# EAGLE design pucktronix.snake.corral.schematic (EAGLE 5.11)
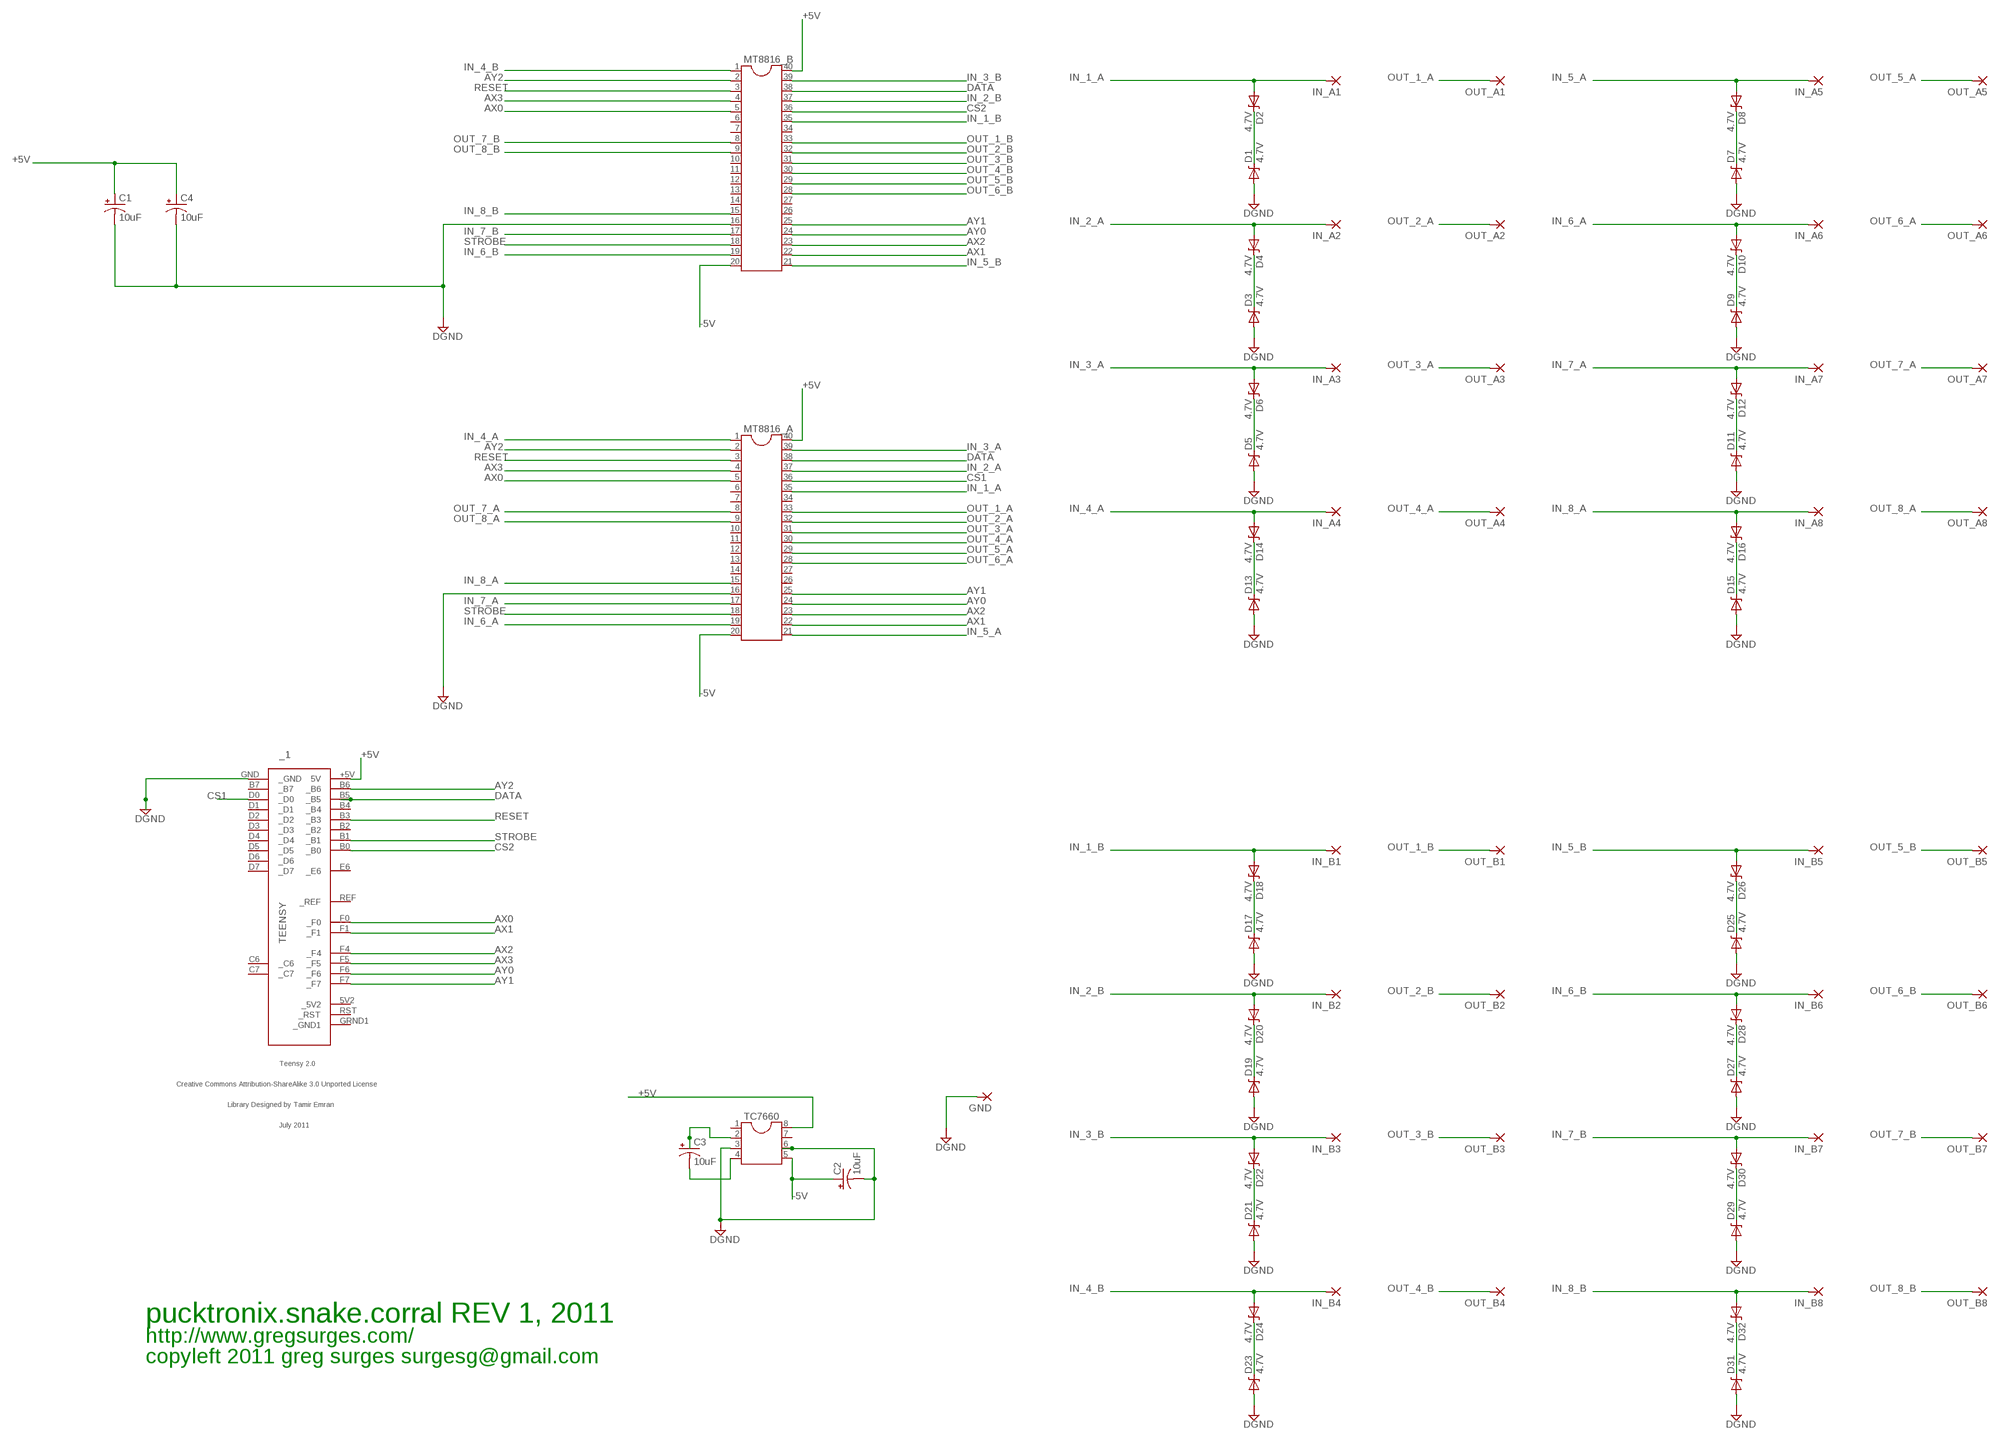
[diagram p0: schematic, sheet 1]

## Parts
_1  TEENSY  [TEENSY]
C1  10uF  CPOL-USE2.5-6  [E2,5-6]
C2  10uF  CPOL-USE2.5-6  [E2,5-6]
C3  10uF  CPOL-USE2.5-6  [E2,5-6]
C4  10uF  CPOL-USE2.5-6  [E2,5-6]
D1  4.7V  DIODE-ZENERPTH  [DIODE-ZENER]
D2  4.7V  DIODE-ZENERPTH  [DIODE-ZENER]
D3  4.7V  DIODE-ZENERPTH  [DIODE-ZENER]
D4  4.7V  DIODE-ZENERPTH  [DIODE-ZENER]
D5  4.7V  DIODE-ZENERPTH  [DIODE-ZENER]
D6  4.7V  DIODE-ZENERPTH  [DIODE-ZENER]
D7  4.7V  DIODE-ZENERPTH  [DIODE-ZENER]
D8  4.7V  DIODE-ZENERPTH  [DIODE-ZENER]
D9  4.7V  DIODE-ZENERPTH  [DIODE-ZENER]
D10  4.7V  DIODE-ZENERPTH  [DIODE-ZENER]
D11  4.7V  DIODE-ZENERPTH  [DIODE-ZENER]
D12  4.7V  DIODE-ZENERPTH  [DIODE-ZENER]
D13  4.7V  DIODE-ZENERPTH  [DIODE-ZENER]
D14  4.7V  DIODE-ZENERPTH  [DIODE-ZENER]
D15  4.7V  DIODE-ZENERPTH  [DIODE-ZENER]
D16  4.7V  DIODE-ZENERPTH  [DIODE-ZENER]
D17  4.7V  DIODE-ZENERPTH  [DIODE-ZENER]
D18  4.7V  DIODE-ZENERPTH  [DIODE-ZENER]
D19  4.7V  DIODE-ZENERPTH  [DIODE-ZENER]
D20  4.7V  DIODE-ZENERPTH  [DIODE-ZENER]
D21  4.7V  DIODE-ZENERPTH  [DIODE-ZENER]
D22  4.7V  DIODE-ZENERPTH  [DIODE-ZENER]
D23  4.7V  DIODE-ZENERPTH  [DIODE-ZENER]
D24  4.7V  DIODE-ZENERPTH  [DIODE-ZENER]
D25  4.7V  DIODE-ZENERPTH  [DIODE-ZENER]
D26  4.7V  DIODE-ZENERPTH  [DIODE-ZENER]
D27  4.7V  DIODE-ZENERPTH  [DIODE-ZENER]
D28  4.7V  DIODE-ZENERPTH  [DIODE-ZENER]
D29  4.7V  DIODE-ZENERPTH  [DIODE-ZENER]
D30  4.7V  DIODE-ZENERPTH  [DIODE-ZENER]
D31  4.7V  DIODE-ZENERPTH  [DIODE-ZENER]
D32  4.7V  DIODE-ZENERPTH  [DIODE-ZENER]
GND  3,81/1,4  [3,81/1,4]
IN_A1  3,81/1,4  [3,81/1,4]
IN_A2  3,81/1,4  [3,81/1,4]
IN_A3  3,81/1,4  [3,81/1,4]
IN_A4  3,81/1,4  [3,81/1,4]
IN_A5  3,81/1,4  [3,81/1,4]
IN_A6  3,81/1,4  [3,81/1,4]
IN_A7  3,81/1,4  [3,81/1,4]
IN_A8  3,81/1,4  [3,81/1,4]
IN_B1  3,81/1,4  [3,81/1,4]
IN_B2  3,81/1,4  [3,81/1,4]
IN_B3  3,81/1,4  [3,81/1,4]
IN_B4  3,81/1,4  [3,81/1,4]
IN_B5  3,81/1,4  [3,81/1,4]
IN_B6  3,81/1,4  [3,81/1,4]
IN_B7  3,81/1,4  [3,81/1,4]
IN_B8  3,81/1,4  [3,81/1,4]
MT8816_A  DIL40  [DIL40]
MT8816_B  DIL40  [DIL40]
OUT_A1  3,81/1,4  [3,81/1,4]
OUT_A2  3,81/1,4  [3,81/1,4]
OUT_A3  3,81/1,4  [3,81/1,4]
OUT_A4  3,81/1,4  [3,81/1,4]
OUT_A5  3,81/1,4  [3,81/1,4]
OUT_A6  3,81/1,4  [3,81/1,4]
OUT_A7  3,81/1,4  [3,81/1,4]
OUT_A8  3,81/1,4  [3,81/1,4]
OUT_B1  3,81/1,4  [3,81/1,4]
OUT_B2  3,81/1,4  [3,81/1,4]
OUT_B3  3,81/1,4  [3,81/1,4]
OUT_B4  3,81/1,4  [3,81/1,4]
OUT_B5  3,81/1,4  [3,81/1,4]
OUT_B6  3,81/1,4  [3,81/1,4]
OUT_B7  3,81/1,4  [3,81/1,4]
OUT_B8  3,81/1,4  [3,81/1,4]
TC7660  DIL8  [DIL08]

## Nets
+5V: _1.+5V(5V) C1.+ C4.+ MT8816_A.40 MT8816_B.40 TC7660.8
-5V: C2.+ MT8816_A.20 MT8816_B.20 TC7660.5
AX0: _1.F0(_F0) MT8816_A.5 MT8816_B.5
AX1: _1.F1(_F1) MT8816_A.22 MT8816_B.22
AX2: _1.F4(_F4) MT8816_A.23 MT8816_B.23
AX3: _1.F5(_F5) MT8816_A.4 MT8816_B.4
AY0: _1.F6(_F6) MT8816_A.24 MT8816_B.24
AY1: _1.F7(_F7) MT8816_A.25 MT8816_B.25
AY2: _1.B6(_B6) MT8816_A.2 MT8816_B.2
CS1: _1.D0(_D0) MT8816_A.36
CS2: _1.B0(_B0) MT8816_B.36
DATA: _1.B5(_B5) MT8816_A.38 MT8816_B.38
DGND: _1.GND(_GND) C1.- C2.- C4.- D1.P$2(A) D3.P$2(A) D5.P$2(A) D7.P$2(A) D9.P$2(A) D11.P$2(A) D13.P$2(A) D15.P$2(A) D17.P$2(A) D19.P$2(A) D21.P$2(A) D23.P$2(A) D25.P$2(A) D27.P$2(A) D29.P$2(A) D31.P$2(A) GND.1(P) MT8816_A.16 MT8816_B.16 TC7660.3 TC7660.6
IN_1_A: D2.P$2(A) IN_A1.1(P) MT8816_A.35
IN_1_B: D18.P$2(A) IN_B1.1(P) MT8816_B.35
IN_2_A: D4.P$2(A) IN_A2.1(P) MT8816_A.37
IN_2_B: D20.P$2(A) IN_B2.1(P) MT8816_B.37
IN_3_A: D6.P$2(A) IN_A3.1(P) MT8816_A.39
IN_3_B: D22.P$2(A) IN_B3.1(P) MT8816_B.39
IN_4_A: D14.P$2(A) IN_A4.1(P) MT8816_A.1
IN_4_B: D24.P$2(A) IN_B4.1(P) MT8816_B.1
IN_5_A: D8.P$2(A) IN_A5.1(P) MT8816_A.21
IN_5_B: D26.P$2(A) IN_B5.1(P) MT8816_B.21
IN_6_A: D10.P$2(A) IN_A6.1(P) MT8816_A.19
IN_6_B: D28.P$2(A) IN_B6.1(P) MT8816_B.19
IN_7_A: D12.P$2(A) IN_A7.1(P) MT8816_A.17
IN_7_B: D30.P$2(A) IN_B7.1(P) MT8816_B.17
IN_8_A: D16.P$2(A) IN_A8.1(P) MT8816_A.15
IN_8_B: D32.P$2(A) IN_B8.1(P) MT8816_B.15
N$1: D1.P$1(C) D2.P$1(C)
N$2: D3.P$1(C) D4.P$1(C)
N$3: D5.P$1(C) D6.P$1(C)
N$4: C3.+ TC7660.2
N$5: D7.P$1(C) D8.P$1(C)
N$6: D9.P$1(C) D10.P$1(C)
N$7: C3.- TC7660.4
N$8: D11.P$1(C) D12.P$1(C)
N$9: D13.P$1(C) D14.P$1(C)
N$10: D15.P$1(C) D16.P$1(C)
N$11: D17.P$1(C) D18.P$1(C)
N$12: D19.P$1(C) D20.P$1(C)
N$13: D21.P$1(C) D22.P$1(C)
N$14: D23.P$1(C) D24.P$1(C)
N$15: D25.P$1(C) D26.P$1(C)
N$16: D27.P$1(C) D28.P$1(C)
N$17: D29.P$1(C) D30.P$1(C)
N$18: D31.P$1(C) D32.P$1(C)
OUT_1_A: MT8816_A.33 OUT_A1.1(P)
OUT_1_B: MT8816_B.33 OUT_B1.1(P)
OUT_2_A: MT8816_A.32 OUT_A2.1(P)
OUT_2_B: MT8816_B.32 OUT_B2.1(P)
OUT_3_A: MT8816_A.31 OUT_A3.1(P)
OUT_3_B: MT8816_B.31 OUT_B3.1(P)
OUT_4_A: MT8816_A.30 OUT_A4.1(P)
OUT_4_B: MT8816_B.30 OUT_B4.1(P)
OUT_5_A: MT8816_A.29 OUT_A5.1(P)
OUT_5_B: MT8816_B.29 OUT_B5.1(P)
OUT_6_A: MT8816_A.28 OUT_A6.1(P)
OUT_6_B: MT8816_B.28 OUT_B6.1(P)
OUT_7_A: MT8816_A.8 OUT_A7.1(P)
OUT_7_B: MT8816_B.8 OUT_B7.1(P)
OUT_8_A: MT8816_A.9 OUT_A8.1(P)
OUT_8_B: MT8816_B.9 OUT_B8.1(P)
RESET: _1.B3(_B3) MT8816_A.3 MT8816_B.3
STROBE: _1.B1(_B1) MT8816_A.18 MT8816_B.18
Unconnected: _1.5V2(_5V2) _1.B2(_B2) _1.B4(_B4) _1.B7(_B7) _1.C6(_C6) _1.C7(_C7) _1.D1(_D1) _1.D2(_D2) _1.D3(_D3) _1.D4(_D4) _1.D5(_D5) _1.D6(_D6) _1.D7(_D7) _1.E6(_E6) _1.GRND1(_GND1) _1.REF(_REF) _1.RST(_RST) MT8816_A.6 MT8816_A.7 MT8816_A.10 MT8816_A.11 MT8816_A.12 MT8816_A.13 MT8816_A.14 MT8816_A.26 MT8816_A.27 MT8816_A.34 MT8816_B.6 MT8816_B.7 MT8816_B.10 MT8816_B.11 MT8816_B.12 MT8816_B.13 MT8816_B.14 MT8816_B.26 MT8816_B.27 MT8816_B.34 TC7660.1 TC7660.7

## Notes on the sheet
- pucktronix.snake.corral REV 1, 2011
- http://www.gregsurges.com/
- copyleft 2011 greg surges surgesg@gmail.com

## Library data of the parts
_1 = teensy:TEENSY: Teensy 2.0 Original Design by Clint Fisher Modified Design by Tamir Emran Licensed Under Creative Commons Attribution-ShareAlike 3.0 Unported (CC BY-SA 3.0)
C1-C4 = rcl:CPOL-US: POLARIZED CAPACITOR, American symbol
D1-D32 = SparkFun:DIODE-ZENER: Zener Diode Production Part - 8199 3.4V Zener Voltage
GND IN_A1-IN_A8 IN_B1-IN_B8 OUT_A1-OUT_A8 OUT_B1-OUT_B8 = wirepad:3,81/1,4: THROUGH-HOLE PAD
MT8816_A MT8816_B = ic-package:DIL40: Dual In Line
TC7660 = ic-package:DIL8: Dual In Line / Socket

## Board
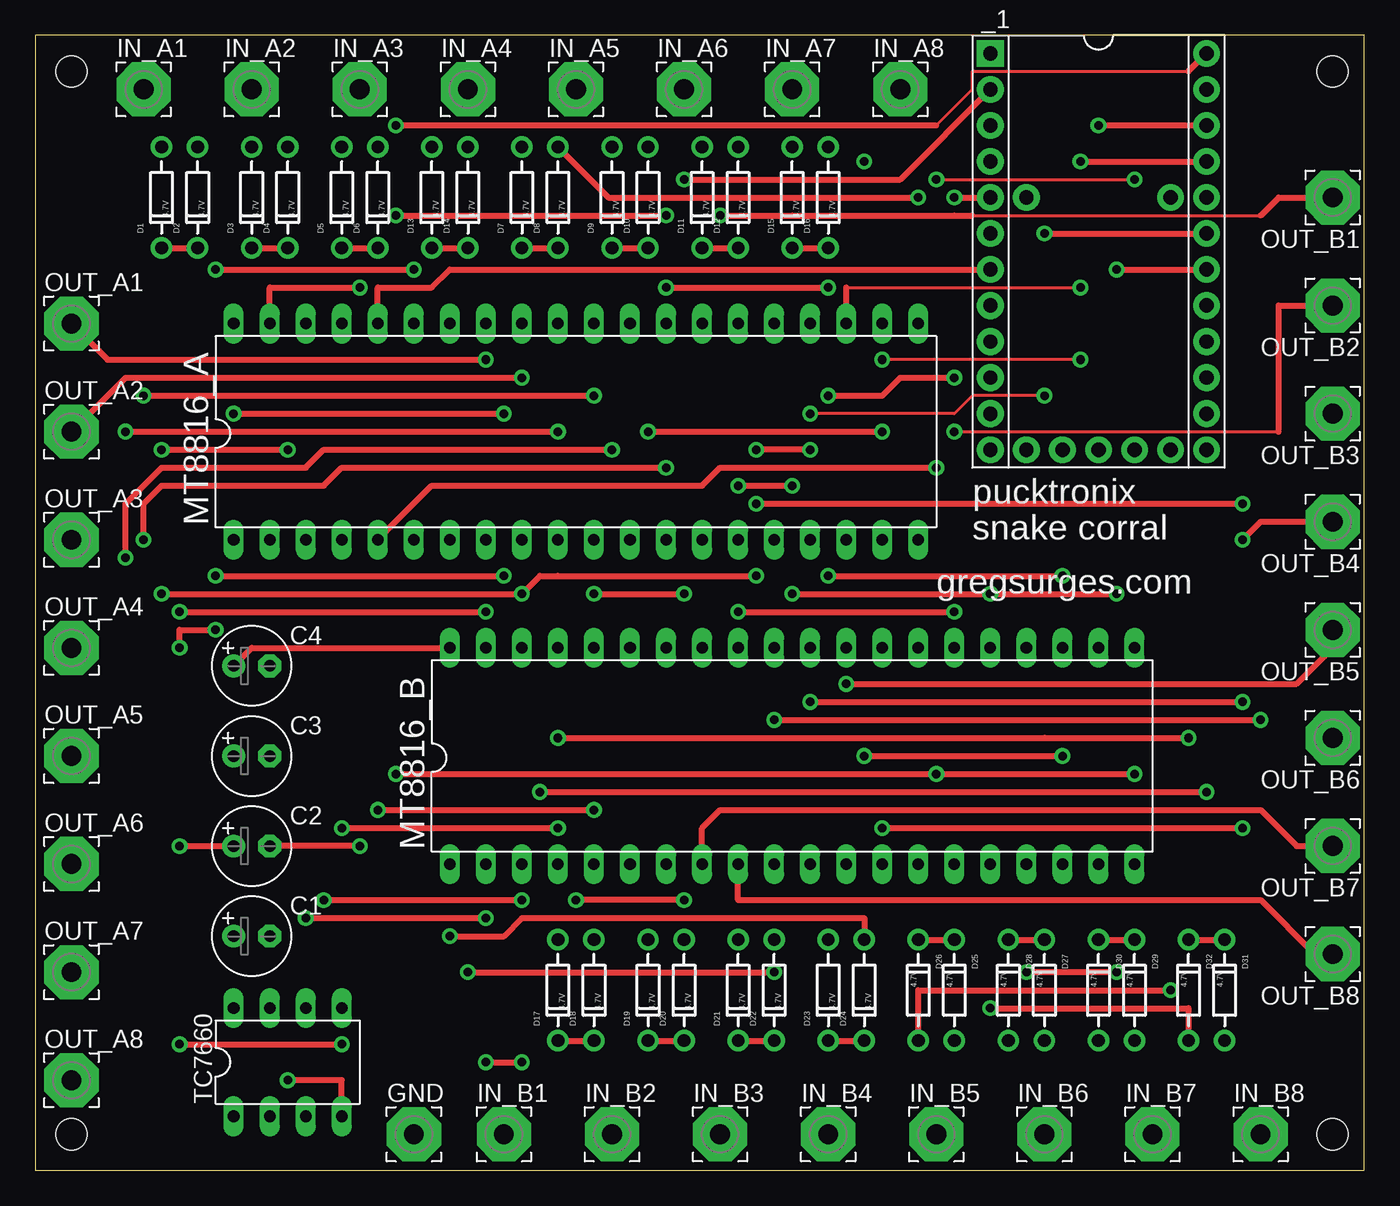
[diagram p1: board, top side]
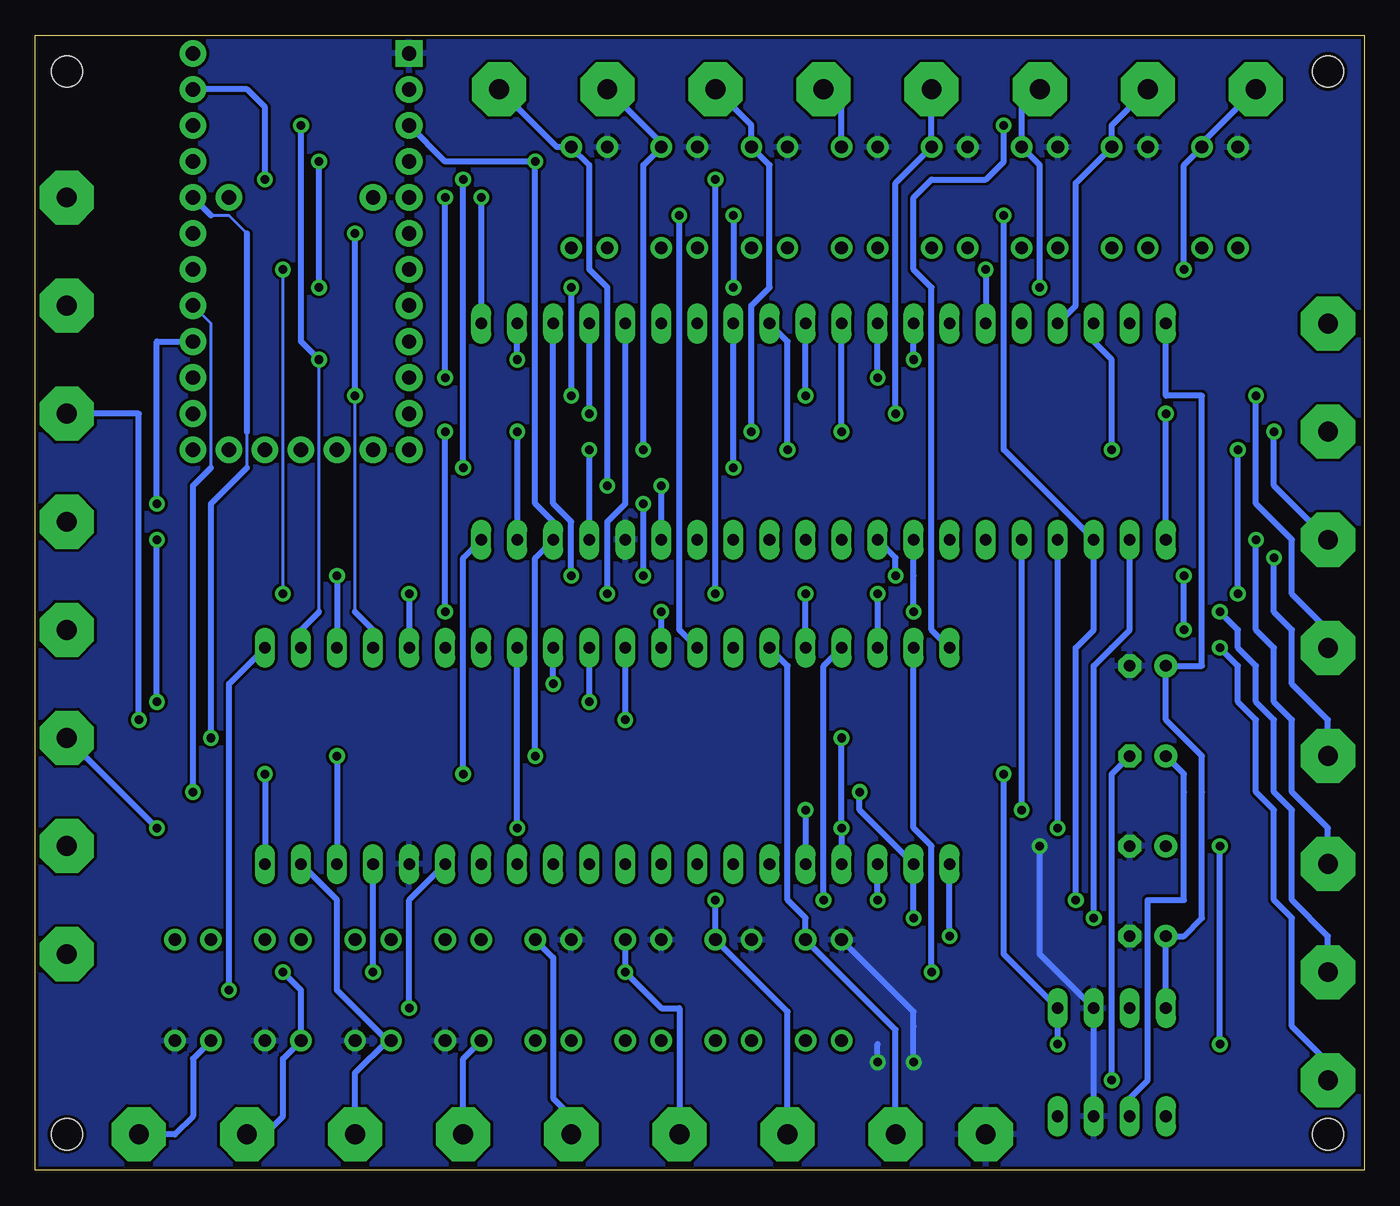
[diagram p2: board, bottom side, seen from below]

Size 93.65 x 80 mm. Coordinates in mm from the lower left corner, seen from the top.
Outline: 0,0 93.65,0 93.65,80 0,80 0,0
Copper layers (1*16): Top 0.035mm / dielectric 1.5mm / Bottom 0.035mm
Design rules "SparkFun": minimum track width 8mil, minimum drill 20mil, track to track 8mil, track to pad 8mil, pad to pad 8mil, via to via 8mil, smd to smd 8mil, copper to edge 10mil, drill to drill 8mil, minimum pad ring 12mil, minimum via ring 10mil, stop-mask expansion 4mil, vias tented up to drill 25mil, thermal gap 10mil
Holes 2.2 mm at 2.54,2.54 91.44,2.54 2.54,77.47 91.44,77.47

### Footprints (pad centres in the part's own frame; a part is rotated, then mirrored left to right if it is on the bottom)
TEENSY = drill 1.016 pad 1.88 round: 5V2 13.97,-2.54; +5V -13.97,7.62; B0 -11.43,-7.62; B1 -8.89,-7.62; B2 -6.35,-7.62; B3 -3.81,-7.62; B4 8.89,7.62; B5 6.35,7.62; B6 3.81,7.62; B7 -1.27,-7.62; C6 11.43,-7.62; C7 13.97,-7.62; D0 1.27,-7.62; D1 3.81,-7.62; D2 6.35,-7.62; D3 8.89,-7.62; D4 13.97,5.08; D5 13.97,-5.08; D6 13.97,7.62; D7 11.43,7.62; E6 -3.81,-5.08; F0 -11.43,7.62; F1 -8.89,7.62; F4 -6.35,7.62; F5 -3.81,7.62; F6 -1.27,7.62; F7 1.27,7.62; GRND1 13.97,0; REF -3.81,5.08; RST 13.97,2.54 | drill 1.016 pad 1.88 square: GND -13.97,-7.62
E2,5-6 = drill 0.813 pad 1.6 round: + -1.27,0 | drill 0.813 pad 1.6 octagon: - 1.27,0
DIODE-ZENER = drill 0.9 round: P$1 -3.556,0; P$2 3.556,0
3,81/1,4 = drill 1.397 pad 3.81 octagon: 1 0,0
DIL40 = drill 0.813 long: 1 -24.13,-7.62; 2 -21.59,-7.62; 3 -19.05,-7.62; 4 -16.51,-7.62; 5 -13.97,-7.62; 6 -11.43,-7.62; 7 -8.89,-7.62; 8 -6.35,-7.62; 9 -3.81,-7.62; 10 -1.27,-7.62; 11 1.27,-7.62; 12 3.81,-7.62; 13 6.35,-7.62; 14 8.89,-7.62; 15 11.43,-7.62; 16 13.97,-7.62; 17 16.51,-7.62; 18 19.05,-7.62; 19 21.59,-7.62; 20 24.13,-7.62; 21 24.13,7.62; 22 21.59,7.62; 23 19.05,7.62; 24 16.51,7.62; 25 13.97,7.62; 26 11.43,7.62; 27 8.89,7.62; 28 6.35,7.62; 29 3.81,7.62; 30 1.27,7.62; 31 -1.27,7.62; 32 -3.81,7.62; 33 -6.35,7.62; 34 -8.89,7.62; 35 -11.43,7.62; 36 -13.97,7.62; 37 -16.51,7.62; 38 -19.05,7.62; 39 -21.59,7.62; 40 -24.13,7.62
DIL08 = drill 0.813 long: 1 -3.81,-3.81; 2 -1.27,-3.81; 3 1.27,-3.81; 4 3.81,-3.81; 5 3.81,3.81; 6 1.27,3.81; 7 -1.27,3.81; 8 -3.81,3.81

### Placement (x,y rotation side)
_1  74.93,64.77 270 top
C1  15.24,16.51 0 top
C2  15.24,22.86 0 top
C3  15.24,29.21 0 top
C4  15.24,35.56 0 top
D1  8.89,68.58 90 top
D2  11.43,68.58 90 top
D3  15.24,68.58 90 top
D4  17.78,68.58 90 top
D5  21.59,68.58 90 top
D6  24.13,68.58 90 top
D7  34.29,68.58 90 top
D8  36.83,68.58 90 top
D9  40.64,68.58 90 top
D10  43.18,68.58 90 top
D11  46.99,68.58 90 top
D12  49.53,68.58 90 top
D13  27.94,68.58 90 top
D14  30.48,68.58 90 top
D15  53.34,68.58 90 top
D16  55.88,68.58 90 top
D17  36.83,12.7 90 top
D18  39.37,12.7 90 top
D19  43.18,12.7 90 top
D20  45.72,12.7 90 top
D21  49.53,12.7 90 top
D22  52.07,12.7 90 top
D23  55.88,12.7 90 top
D24  58.42,12.7 90 top
D25  64.77,12.7 270 top
D26  62.23,12.7 270 top
D27  71.12,12.7 270 top
D28  68.58,12.7 270 top
D29  77.47,12.7 270 top
D30  74.93,12.7 270 top
D31  83.82,12.7 270 top
D32  81.28,12.7 270 top
GND  26.67,2.54 0 top
IN_A1  7.62,76.2 0 top
IN_A2  15.24,76.2 0 top
IN_A3  22.86,76.2 0 top
IN_A4  30.48,76.2 0 top
IN_A5  38.1,76.2 0 top
IN_A6  45.72,76.2 0 top
IN_A7  53.34,76.2 0 top
IN_A8  60.96,76.2 0 top
IN_B1  33.02,2.54 0 top
IN_B2  40.64,2.54 0 top
IN_B3  48.26,2.54 0 top
IN_B4  55.88,2.54 0 top
IN_B5  63.5,2.54 0 top
IN_B6  71.12,2.54 0 top
IN_B7  78.74,2.54 0 top
IN_B8  86.36,2.54 0 top
MT8816_A  38.1,52.07 0 top
MT8816_B  53.34,29.21 0 top
OUT_A1  2.54,59.69 0 top
OUT_A2  2.54,52.07 0 top
OUT_A3  2.54,44.45 0 top
OUT_A4  2.54,36.83 0 top
OUT_A5  2.54,29.21 0 top
OUT_A6  2.54,21.59 0 top
OUT_A7  2.54,13.97 0 top
OUT_A8  2.54,6.35 0 top
OUT_B1  91.44,68.58 180 top
OUT_B2  91.44,60.96 180 top
OUT_B3  91.44,53.34 180 top
OUT_B4  91.44,45.72 180 top
OUT_B5  91.44,38.1 180 top
OUT_B6  91.44,30.48 180 top
OUT_B7  91.44,22.86 180 top
OUT_B8  91.44,15.24 180 top
TC7660  17.78,7.62 0 top

### Tracks (layer width: path | path; a pad name or v marks a point on that pad's centre or on a via)
+5V  (via drill 0.6)
  Top 0.203: 63.5,73.66 66.04,76.2 66.04,77.47 81.28,77.47
  Top 0.406: C4.+ 15.24,36.83 MT8816_B.40 | v25.4,73.66 63.5,73.66 | 81.28,77.47 _1.+5V
  Bottom 0.406: MT8816_A.40 13.97,54.61 11.43,54.61 11.43,35.56 C4.+ 13.97,31.75 11.43,29.21 11.43,26.67 11.43,17.78 12.7,16.51 C1.+ TC7660.8 | MT8816_B.40 30.48,38.1 30.48,62.23 31.75,63.5 31.75,68.58 30.48,69.85 26.67,69.85 25.4,71.12 v25.4,73.66
-5V  (via drill 0.6)
  Top 0.406: v77.47,27.94 v63.5,27.94 v25.4,27.94 | v10.16,22.86 C2.+ | v10.16,8.89 v21.59,8.89
  Bottom 0.406: MT8816_A.20 63.5,43.18 v63.5,27.94 | v77.47,27.94 MT8816_B.20 | v10.16,8.89 v10.16,22.86 | v21.59,8.89 TC7660.5 25.4,15.24 25.4,26.67 v25.4,27.94
AX0  (via drill 0.6)
  Top 0.203: v63.5,69.85 v77.47,69.85
  Top 0.406: v24.13,25.4 v39.37,25.4 | MT8816_A.5 27.94,48.26 46.99,48.26 48.26,49.53 49.53,49.53 v63.5,49.53
  Bottom 0.406: v24.13,25.4 MT8816_A.5 | v39.37,25.4 MT8816_B.5 | v63.5,49.53 v63.5,69.85 | v77.47,69.85 77.47,74.93 78.74,76.2 _1.F0
AX1  (via drill 0.6)
  Top 0.203: v73.66,57.15 v59.69,57.15
  Top 0.406: v74.93,73.66 _1.F1
  Bottom 0.203: 73.66,39.37 v73.66,57.15
  Bottom 0.406: v59.69,57.15 MT8816_A.22 | 73.66,39.37 74.93,38.1 MT8816_B.22 | v73.66,57.15 74.93,58.42 v74.93,73.66
AX2  (via drill 0.6)
  Top 0.203: 57.15,62.23 v73.66,62.23
  Top 0.406: v55.88,41.91 v72.39,41.91 | MT8816_A.23 57.15,62.23 | v73.66,71.12 _1.F4
  Bottom 0.406: MT8816_A.23 57.15,46.99 55.88,45.72 v55.88,41.91 | v72.39,41.91 MT8816_B.23 | v73.66,62.23 v73.66,71.12
AX3  (via drill 0.6)
  Top 0.406: v21.59,24.13 v36.83,24.13 | v36.83,30.48 71.12,30.48 v81.28,30.48
  Bottom 0.203: 78.74,49.53 78.74,52.07 | 78.74,66.04 80.01,67.31 81.28,67.31
  Bottom 0.406: v21.59,24.13 MT8816_A.4 | MT8816_B.4 v36.83,24.13 v36.83,30.48 | v81.28,30.48 81.28,46.99 78.74,49.53 | 78.74,52.07 78.74,66.04 | 81.28,67.31 _1.F5
AY0  (via drill 0.6)
  Top 0.203: v54.61,53.34 64.77,53.34 66.04,54.61 v71.12,54.61
  Top 0.406: v71.12,66.04 _1.F6
  Bottom 0.203: 71.12,39.37 v71.12,54.61
  Bottom 0.406: v54.61,53.34 MT8816_A.24 | 71.12,39.37 69.85,38.1 MT8816_B.24 | v71.12,54.61 v71.12,66.04
AY1  (via drill 0.6)
  Top 0.406: v53.34,40.64 v67.31,40.64 v76.2,40.64 | v76.2,63.5 _1.F7
  Bottom 0.203: v76.2,40.64 v76.2,63.5
  Bottom 0.406: MT8816_A.25 52.07,46.99 53.34,45.72 v53.34,40.64 | v67.31,40.64 MT8816_B.25
AY2  (via drill 0.6)
  Top 0.406: v19.05,17.78 v31.75,17.78 | v35.56,26.67 81.28,26.67 v82.55,26.67
  Bottom 0.203: 81.28,49.53 81.28,59.69 _1.B6
  Bottom 0.406: MT8816_A.2 16.51,38.1 17.78,36.83 19.05,35.56 v19.05,17.78 | v31.75,17.78 MT8816_B.2 35.56,25.4 v35.56,26.67 | v82.55,26.67 82.55,48.26 81.28,49.53
CS1
  Top 0.406: MT8816_A.36 24.13,62.23 27.94,62.23 29.21,63.5 _1.D0
CS2  (via drill 0.6)
  Top 0.406: _1.B0 60.96,69.85 v45.72,69.85 | v39.37,40.64 v45.72,40.64
  Bottom 0.406: v45.72,40.64 v45.72,69.85 | MT8816_B.36 v39.37,40.64
DATA  (via drill 0.6)
  Top 0.406: v8.89,50.8 v17.78,50.8 | v8.89,40.64 v34.29,40.64 35.56,41.91 36.83,41.91 v50.8,41.91 | v50.8,46.99 v85.09,46.99
  Bottom 0.406: v8.89,40.64 v8.89,50.8 | v34.29,40.64 MT8816_B.38 | v50.8,41.91 v50.8,46.99 | v85.09,46.99 85.09,58.42 _1.B5 | v17.78,50.8 17.78,57.15 19.05,58.42 MT8816_A.38
DGND  (via drill 0.6)
  Top 0.406: v31.75,7.62 v34.29,7.62 | v22.86,22.86 C2.-
  Bottom 0.406: D17.P$2 31.75,11.18 31.75,10.16 v31.75,7.62 | v34.29,7.62 34.29,8.89 | TC7660.3 TC7660.6 22.86,15.24 v22.86,22.86
  pour Bottom: 0,80.01 93.98,80.01 93.98,0 0,0
IN_1_A  (via drill 0.6)
  Top 0.406: v12.7,63.5 v26.67,63.5
  Bottom 0.406: IN_A1.1 11.43,72.39 D2.P$2 12.7,70.87 v12.7,63.5 | v26.67,63.5 MT8816_A.35
IN_1_B
  Bottom 0.406: MT8816_B.35 40.64,35.56 40.64,19.05 39.37,17.78 D18.P$2 33.02,9.91 IN_B1.1
IN_2_A
  Bottom 0.406: IN_A2.1 17.78,73.66 D4.P$2 20.32,69.6 20.32,60.96 MT8816_A.37
IN_2_B  (via drill 0.6)
  Top 0.406: v45.72,19.05 v38.1,19.05
  Bottom 0.406: MT8816_B.37 38.1,35.56 v38.1,19.05 | v45.72,19.05 D20.P$2 40.64,11.18 IN_B2.1
IN_3_A  (via drill 0.6)
  Top 0.406: v22.86,62.23 16.51,62.23 MT8816_A.39
  Bottom 0.406: IN_A3.1 24.13,74.93 24.13,72.39 D6.P$2 22.86,70.87 v22.86,62.23
IN_3_B  (via drill 0.6)
  Top 0.406: v30.48,13.97 v52.07,13.97
  Bottom 0.406: MT8816_B.39 31.75,24.13 30.48,22.86 v30.48,13.97 | D22.P$2 v52.07,13.97 49.53,11.43 48.26,11.43 IN_B3.1
IN_4_A  (via drill 0.6)
  Top 0.406: v13.97,53.34 v33.02,53.34
  Bottom 0.406: IN_A4.1 D14.P$2 33.02,69.6 v33.02,53.34 | MT8816_A.1 v13.97,53.34
IN_4_B  (via drill 0.6)
  Top 0.406: D24.P$2 58.42,17.78 36.83,17.78 34.29,17.78 33.02,16.51 v29.21,16.51
  Bottom 0.406: v29.21,16.51 MT8816_B.1 | D24.P$2 57.15,14.99 57.15,5.08 55.88,3.81 IN_B4.1
IN_5_A  (via drill 0.6)
  Top 0.406: D8.P$2 40.39,68.58 v62.23,68.58
  Bottom 0.406: IN_A5.1 36.83,74.93 D8.P$2 | v62.23,68.58 MT8816_A.21
IN_5_B  (via drill 0.6)
  Top 0.406: D26.P$2 62.23,12.7 v80.01,12.7
  Bottom 0.406: v80.01,12.7 80.01,34.29 MT8816_B.21 | D26.P$2 63.5,7.87 IN_B5.1
IN_6_A  (via drill 0.6)
  Top 0.406: v43.18,52.07 v59.69,52.07
  Bottom 0.406: IN_A6.1 43.18,73.66 D10.P$2 41.91,70.87 41.91,62.23 43.18,60.96 v43.18,52.07 | v59.69,52.07 MT8816_A.19
IN_6_B
  Bottom 0.406: MT8816_B.19 72.39,19.05 72.39,12.7 68.83,9.14 | 68.83,9.14 D28.P$2 | 68.83,9.14 71.12,6.86 IN_B6.1
IN_7_A  (via drill 0.6)
  Top 0.406: v54.61,50.8 v50.8,50.8
  Bottom 0.406: IN_A7.1 49.53,72.39 D12.P$2 50.8,70.87 v50.8,50.8 | MT8816_A.17 v54.61,50.8
IN_7_B  (via drill 0.6)
  Top 0.406: v76.2,13.97 v69.85,13.97
  Bottom 0.406: v69.85,13.97 MT8816_B.17 | v76.2,13.97 74.93,12.7 D30.P$2 76.2,7.87 76.2,3.81 77.47,2.54 IN_B7.1
IN_8_A  (via drill 0.6)
  Top 0.406: v49.53,48.26 v53.34,48.26
  Bottom 0.406: IN_A8.1 56.9,72.14 D16.P$2 54.61,70.87 54.61,63.5 53.34,62.23 v53.34,48.26 | MT8816_A.15 v49.53,48.26
IN_8_B  (via drill 0.6)
  Top 0.406: v67.31,11.43 81.28,11.43 D32.P$2
  Bottom 0.406: MT8816_B.15 67.31,19.05 v67.31,11.43 | D32.P$2 82.55,7.87 82.55,3.81 83.82,2.54 IN_B8.1
N$1
  Top 0.406: D1.P$1 D2.P$1
N$2
  Top 0.406: D3.P$1 D4.P$1
N$3
  Top 0.406: D5.P$1 D6.P$1
N$4
  Bottom 0.406: C3.+ 12.7,27.94 12.7,26.67 12.7,19.05 15.24,19.05 15.24,11.43 15.24,6.35 16.51,5.08 TC7660.2
N$5
  Top 0.406: D7.P$1 D8.P$1
N$6
  Top 0.406: D9.P$1 D10.P$1
N$7  (via drill 0.6)
  Top 0.406: v17.78,6.35 21.59,6.35 TC7660.4
  Bottom 0.406: C3.- 17.78,27.94 17.78,8.89 v17.78,6.35
N$8
  Top 0.406: D11.P$1 D12.P$1
N$9
  Top 0.406: D13.P$1 D14.P$1
N$10
  Top 0.406: D15.P$1 D16.P$1
N$11
  Top 0.406: D17.P$1 D18.P$1
N$12
  Top 0.406: D19.P$1 D20.P$1
N$13
  Top 0.406: D21.P$1 D22.P$1
N$14
  Top 0.406: D23.P$1 D24.P$1
N$15
  Top 0.406: D26.P$1 D25.P$1
N$16
  Top 0.406: D28.P$1 D27.P$1
N$17
  Top 0.406: D30.P$1 D29.P$1
N$18
  Top 0.406: D32.P$1 D31.P$1
OUT_1_A  (via drill 0.6)
  Top 0.406: OUT_A1.1 5.08,57.15 v31.75,57.15
  Bottom 0.406: v31.75,57.15 MT8816_A.33
OUT_1_B  (via drill 0.6)
  Top 0.203: 66.04,67.31 86.36,67.31
  Top 0.406: v48.26,67.31 53.34,67.31 64.77,67.31 66.04,67.31 | 86.36,67.31 87.63,68.58 OUT_B1.1
  Bottom 0.406: MT8816_B.33 48.26,38.1 48.26,58.42 v48.26,67.31
OUT_2_A  (via drill 0.6)
  Top 0.406: OUT_A2.1 6.35,55.88 v34.29,55.88
  Bottom 0.406: v34.29,55.88 MT8816_A.32
OUT_2_B  (via drill 0.6)
  Top 0.203: v64.77,52.07 80.01,52.07 87.63,52.07
  Top 0.406: v49.53,39.37 v64.77,39.37 | 87.63,52.07 87.63,60.96 OUT_B2.1
  Bottom 0.406: MT8816_B.32 v49.53,39.37 | v64.77,39.37 v64.77,52.07
OUT_3_A  (via drill 0.6)
  Top 0.406: v6.35,52.07 v36.83,52.07
  Bottom 0.406: OUT_A3.1 6.35,48.26 v6.35,52.07 | v36.83,52.07 MT8816_A.31
OUT_3_B  (via drill 0.6)
  Top 0.406: v52.07,31.75 v86.36,31.75
  Bottom 0.406: v52.07,31.75 MT8816_B.31 | v86.36,31.75 86.36,53.34 OUT_B3.1
OUT_4_A  (via drill 0.6)
  Top 0.406: v7.62,54.61 v39.37,54.61
  Bottom 0.406: v39.37,54.61 MT8816_A.30 | v7.62,54.61 7.62,46.99 5.08,44.45 5.08,40.64 2.54,38.1 OUT_A4.1
OUT_4_B  (via drill 0.6)
  Top 0.406: v54.61,33.02 v85.09,33.02 | v85.09,44.45 86.36,45.72 OUT_B4.1
  Bottom 0.406: v54.61,33.02 MT8816_B.30 | v85.09,33.02 v85.09,44.45
OUT_5_A  (via drill 0.6)
  Top 0.406: v40.64,50.8 20.32,50.8 19.05,49.53 8.89,49.53 6.35,46.99 v6.35,43.18
  Bottom 0.406: MT8816_A.29 40.64,58.42 v40.64,50.8 | v6.35,43.18 6.35,39.37 5.08,38.1 5.08,34.29 2.54,31.75 OUT_A5.1
OUT_5_B  (via drill 0.6)
  Top 0.406: v57.15,34.29 88.9,34.29 91.44,36.83 OUT_B5.1
  Bottom 0.406: v57.15,34.29 MT8816_B.29
OUT_6_A  (via drill 0.6)
  Top 0.406: v44.45,49.53 21.59,49.53 20.32,48.26 8.89,48.26 7.62,46.99 v7.62,44.45
  Bottom 0.406: v44.45,49.53 MT8816_A.28 | v7.62,44.45 7.62,38.1 6.35,36.83 6.35,33.02 5.08,31.75 5.08,26.67 2.54,24.13 2.54,22.86 OUT_A6.1
OUT_6_B  (via drill 0.6)
  Top 0.406: v59.69,24.13 v85.09,24.13
  Bottom 0.406: v59.69,24.13 MT8816_B.28 | v85.09,24.13 OUT_B6.1
OUT_7_A  (via drill 0.6)
  Top 0.406: v10.16,39.37 v31.75,39.37
  Bottom 0.406: MT8816_A.8 31.75,41.91 v31.75,39.37 | v10.16,39.37 8.89,38.1 8.89,36.83 7.62,35.56 7.62,33.02 6.35,31.75 6.35,26.67 5.08,25.4 5.08,19.05 2.54,16.51 OUT_A7.1
OUT_7_B
  Top 0.406: MT8816_B.8 46.99,24.13 48.26,25.4 53.34,25.4 86.36,25.4 88.9,22.86 OUT_B7.1
OUT_8_A  (via drill 0.6)
  Top 0.406: v12.7,41.91 v33.02,41.91 | v12.7,38.1 10.16,38.1 v10.16,36.83
  Bottom 0.406: MT8816_A.9 33.02,43.18 v33.02,41.91 | v12.7,38.1 v12.7,41.91 | v10.16,36.83 8.89,35.56 8.89,33.02 7.62,31.75 7.62,26.67 6.35,25.4 6.35,19.05 5.08,17.78 5.08,10.16 2.54,7.62 OUT_A8.1 | OUT_A8.1 2.54,5.08 OUT_A8.1
OUT_8_B
  Top 0.406: MT8816_B.9 49.53,19.05 86.36,19.05 90.17,15.24 OUT_B8.1
RESET  (via drill 0.6)
  Top 0.406: v20.32,19.05 v34.29,19.05 | v25.4,67.31 v44.45,67.31 | v44.45,62.23 v55.88,62.23 | v55.88,54.61 59.69,54.61 60.96,55.88 v64.77,55.88 | v64.77,68.58 _1.B3
  Bottom 0.406: v20.32,19.05 20.32,36.83 19.05,38.1 MT8816_A.3 25.4,50.8 v25.4,67.31 | v34.29,19.05 MT8816_B.3 | v44.45,67.31 v44.45,62.23 | v55.88,62.23 v55.88,54.61 | v64.77,55.88 v64.77,68.58
STROBE  (via drill 0.6)
  Top 0.406: v58.42,29.21 v72.39,29.21
  Bottom 0.406: v58.42,29.21 58.42,43.18 MT8816_A.18 57.15,45.72 58.42,46.99 v58.42,71.12 64.77,71.12 _1.B1 | v72.39,29.21 MT8816_B.18

### Text on the board
tNames: pucktronix | snake corral | gregsurges.com